# Altium schematic sheet REF_Sensor_TempHumPress.SchDoc
size A4; SheetNumber: 8; SheetTotal: 8
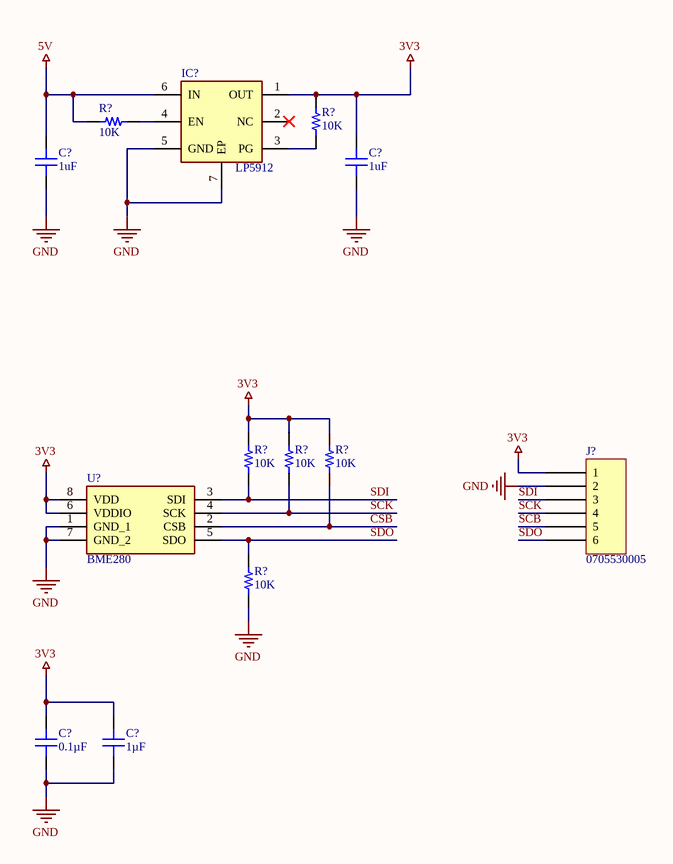
[diagram p0: REF_Sensor_TempHumPress.SchDoc]

## Parts
(Parts that share a designator on the sheet are numbered #1, #2 ... from top to bottom, then left to right.)
C?#1  1uF  [CAP 0603/1608]
C?#2  1uF  [CAP 0603/1608]
C?#3  0.1µF  [CAP 0603_1608]
C?#4  1µF  [CAP 0603_1608]
IC?  LP5912  [SON65P200X200X80-7N]
J?  0705530005  [MOLEX SDA-70553-6PIN]
R?#1  10K  [RES 0603/1608]
R?#2  10K  [RES 0603/1608]
R?#3  10K  [RES 0603/1608]
R?#4  10K  [RES 0603/1608]
R?#5  10K  [RES 0603/1608]
R?#6  10K  [RES 0603/1608]
U?  BME280  [BME280]

## Nets
3V3: C?#2.2 C?#3.1 C?#4.2 IC?.1(OUT) J?.1 R?#2.2 R?#3.2 R?#4.2 R?#5.2 U?.6(VDDIO) U?.8(VDD)
5V: C?#1.2 IC?.6(IN) R?#1.1
GND: C?#1.1 C?#2.1 C?#3.2 C?#4.1 IC?.5(GND) IC?.7(EP) J?.2 R?#6.1 U?.1(GND_1) U?.7(GND_2)
CSB: R?#5.1 U?.2(CSB)
SCB: J?.5
SCK: J?.4 R?#4.1 U?.4(SCK)
SDI: J?.3 R?#3.1 U?.3(SDI)
SDO: J?.6 R?#6.2 U?.5(SDO)
NetIC?_3: IC?.3(PG) R?#2.1
NetIC?_4: IC?.4(EN) R?#1.2

Not connected (* = marked no-connect by the designer): IC? 2(NC)*

## Library data of the parts
C?#1 C?#2 = CL10B105KP8NNNC: CAP CER 1UF 10V X7R 0603; Manufacturer: Samsung Electro-Mechanics America, Inc.; TemperatureRange: -55C ~ 125C; Tolerance: 10%; Value: 1uF; Part Number: CL10B105KP8NNNC; PartId: 13241; Supplier 1: Digi-Key; Supplier Part Number 1: 1276-1946-2-ND; ComponentLink1Description: Datasheet; ComponentLink1URL: http://www.samsungsem.com/kr/support/product-search/mlcc/CL10B105KP8NNNC.jsp; ComponentLink2Description: Digi-Key Listing; ComponentLink2URL: https://www.digikey.com/product-detail/en/samsung-electro-mechanics-america-inc/CL10B105KP8NNNC/1276-1946-2-ND/3887604; TemperatureCoefficient: X7R; Voltage: 10V; Price: 0.0078; Device Package: 0603 (1608 Metric)
C?#3 = 06033C104JAT2A: CAP CER 0.1UF 25V X7R 0603; Manufacturer: AVX Corporation; Tolerance: ±5%; Part Number: 06033C104JAT2A; Value: 0.1µF; Applications: General Purpose; Capacitance: 0.1µF; ComponentLink1Description: Datasheet; ComponentLink1URL: http://datasheets.avx.com/X7RDielectric.pdf; ComponentLink2Description: DigiKey Link; ComponentLink2URL: http://digikey.com/product-detail/en/avx-corporation/06033C104JAT2A/478-3713-1-ND/1116411; Device Package: 0603 (1608 Metric); LastUpdated: 9/2/2020 1:03:17 AM; Lifecycle Status: Active; Minimum Order: 1; Mounting Type: Surface Mount, MLCC; Operating Temperature: -55°C ~ 125°C; Package / Case: 0603 (1608 Metric); Packaging: TapeAndReel; PartId: 12698; Part Status: Active; Price: 0.07; Series: -; Size / Dimension: 0.063" L x 0.032" W (1.60mm x 0.81mm); Supplier 1: DigiKey; Supplier Part Number 1: 478-3713-1-ND; Temperature Coefficient: X7R; Thickness (Max): 0.035" (0.90mm); Voltage - Rated: 25V
C?#4 = 06033C105KAT2A: CAP CER 1UF 25V X7R 0603; Manufacturer: AVX Corporation; Tolerance: ±10%; Part Number: 06033C105KAT2A; Value: 1µF; Applications: General Purpose; Capacitance: 1µF; ComponentLink1Description: Datasheet; ComponentLink1URL: http://datasheets.avx.com/X7RDielectric.pdf; ComponentLink2Description: DigiKey Link; ComponentLink2URL: http://digikey.com/product-detail/en/avx-corporation/06033C105KAT2A/478-10046-1-ND/6564269; Device Package: 0603 (1608 Metric); LastUpdated: 9/2/2020 1:03:32 AM; Lifecycle Status: Active; Minimum Order: 1; Mounting Type: Surface Mount, MLCC; Operating Temperature: -55°C ~ 125°C; Package / Case: 0603 (1608 Metric); Packaging: TapeAndReel; PartId: 4115; Part Status: Active; Price: 0.07; Series: -; Size / Dimension: 0.063" L x 0.032" W (1.60mm x 0.81mm); Supplier 1: DigiKey; Supplier Part Number 1: 478-10046-1-ND; Temperature Coefficient: X7R; Thickness (Max): 0.037" (0.94mm); Voltage - Rated: 25V
IC? = LP5912-3.3DRVR: IC Sensor TempHumPress 3.3V; Manufacturer_Name: Texas Instruments; Datasheet Link: http://www.ti.com/lit/gpn/lp5912; Height: 0.8mm; Manufacturer_Part_Number: LP5912-3.3DRVR; Mouser Part Number: 595-LP5912-3.3DRVR; Mouser Price/Stock: https://www.mouser.co.uk/ProductDetail/Texas-Instruments/LP5912-3.3DRVR?qs=n%252BTO0c4TDSY0RMrHlK%2FGvQ%3D%3D; Arrow Part Number: LP5912-3.3DRVR; Arrow Price/Stock: https://www.arrow.com/en/products/lp5912-3.3drvr/texas-instruments
J? = 0705530005: CONN HEADER R/A 6POS 2.54MM; Manufacturer: Molex; Contact Length - Mating: 0.240" (6.10mm); Contact Length - Post: 0.130" (3.30mm); Material Flammability Rating: UL94 V-0; Number of Positions: 6; Number of Positions Loaded: All; Pitch - Mating: 0.100" (2.54mm); Shrouding: Shrouded - 4 Wall; Style: Board to Cable/Wire; Voltage Rating: 250V; Part Number: 0705530005; ComponentLink1Description: Datasheet; ComponentLink1URL: https://www.molex.com/pdm_docs/sd/705530005_sd.pdf; ComponentLink2Description: DigiKey Link; ComponentLink2URL: http://digikey.com/product-detail/en/molex/0705530005/WM4904-ND/114967; Connector Type: Header; Contact Finish - Mating: Gold; Contact Finish - Post: Tin; Contact Finish Thickness - Mating: 15.0µin (0.38µm); Contact Material: Phosphor Bronze; Contact Shape: Square; Contact Type: Male Pin; Fastening Type: Latch Holder; Insulation Color: Black; Insulation Height: 0.215" (5.45mm); Insulation Material: Polyester, Glass Filled; LastUpdated: 1/12/2020 11:56:47 PM; Lifecycle Status: Active; Minimum Order: 1; Mounting Type: Through Hole, Right Angle; Number of Rows: 1; Operating Temperature: -40°C ~ 105°C; Packaging: Tube; PartId: 89; Part Status: Active; Price: 1.80; Series: SL 70553; Supplier 1: DigiKey; Supplier Part Number 1: WM4904-ND; Termination: Solder
R?#1-R?#6 = 0603S8J0103: RES SMD 10K OHM 5% 1/8W 0603; Manufacturer: Uniohm; TemperatureRange: -55C ~ 155C; TemperatureCoefficient: 100ppm/C; PowerRating: 0.125W, 1/8W; Value: 10K; Part Number: 0603S8J0103; Tolerance: 5%; Price: 0.0089; Device Package: 1608 (0603 Metric)
U? = BME280: MEMS humidity, pressure and temperature sensor